# EAGLE schematic Tracking_Bug (EAGLE 7.5.0)
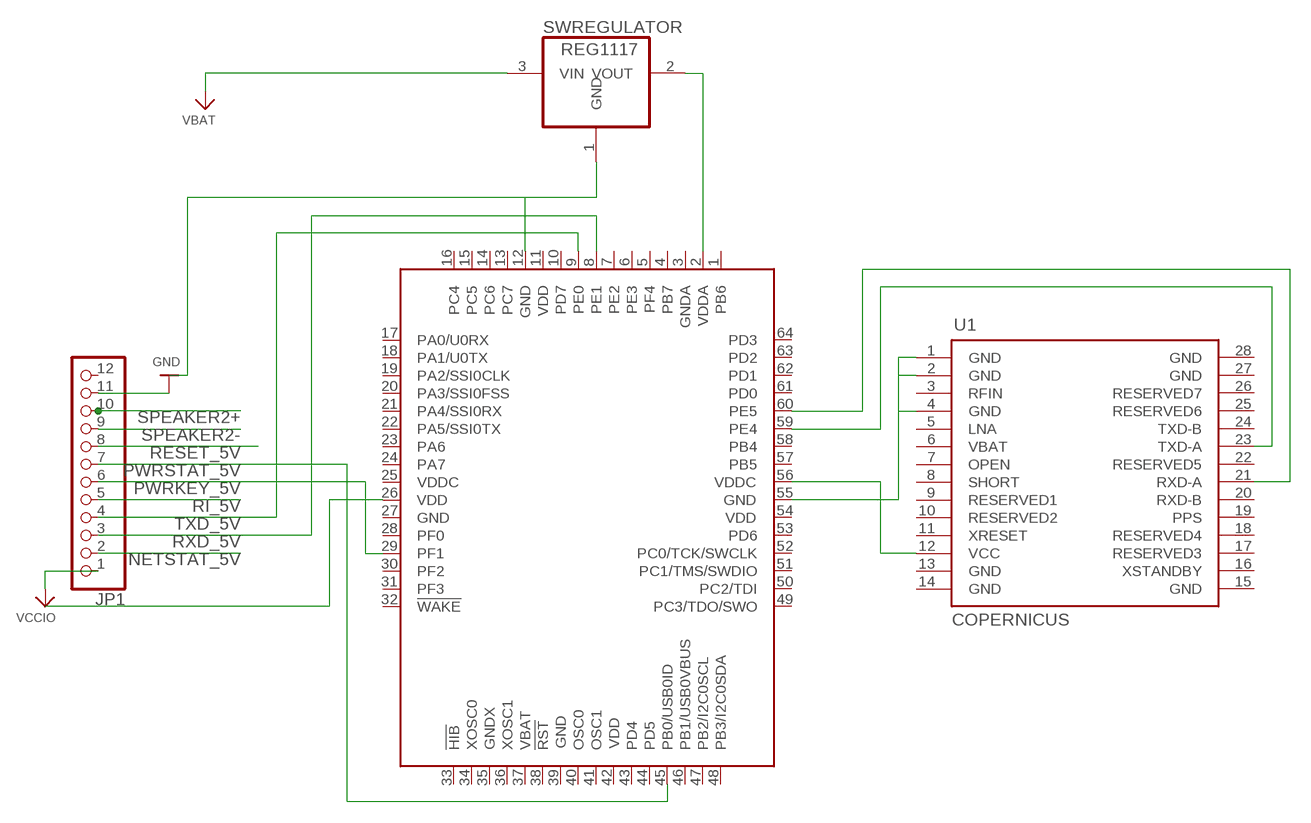
[diagram p0: schematic, sheet 1]

## Parts
IC1  TM4C123[7,G]XXPM  [PM_S-PQFP-G64]
JP1  PINHD-1X12-CB  [1X12-CB]
SWREGULATOR  REG1117  [SOT223]
U1  COPERNICUS  COPERNICUSSMD  [COPERNICUS]

## Nets
GND: JP1.11
N$1: IC1.59(PE4) U1.23(TXD-A)
N$2: IC1.60(PE5) U1.21(RXD-A)
N$3: IC1.55(GND) U1.1(GND) U1.2(GND) U1.4(GND)
N$4: IC1.56(VDDC) U1.12(VCC)
N$5: IC1.26(VDD)
N$6: IC1.12(GND) SWREGULATOR.1(GND)
N$8: IC1.2(VDDA) SWREGULATOR.2(VOUT)
NETSTAT_5V: JP1.2
PWRKEY_5V: IC1.29(PF1) JP1.6
PWRSTAT_5V: IC1.45(PB0/USB0ID) JP1.7
RESET_5V: JP1.8
RI_5V: JP1.5
RXD_5V: IC1.8(PE1) JP1.3
SPEAKER2+: JP1.10
SPEAKER2-: JP1.9
TXD_5V: IC1.9(PE0) JP1.4
VBAT: SWREGULATOR.3(VIN)
VCCIO: JP1.1
Unconnected: IC1.1(PB6) IC1.3(GNDA) IC1.4(PB7) IC1.5(PF4) IC1.6(PE3) IC1.7(PE2) IC1.10(PD7) IC1.11(VDD) IC1.13(PC7) IC1.14(PC6) IC1.15(PC5) IC1.16(PC4) IC1.17(PA0/U0RX) IC1.18(PA1/U0TX) IC1.19(PA2/SSI0CLK) IC1.20(PA3/SSI0FSS) IC1.21(PA4/SSI0RX) IC1.22(PA5/SSI0TX) IC1.23(PA6) IC1.24(PA7) IC1.25(VDDC) IC1.27(GND) IC1.28(PF0) IC1.30(PF2) IC1.31(PF3) IC1.32(!WAKE) IC1.33(!HIB) IC1.34(XOSC0) IC1.35(GNDX) IC1.36(XOSC1) IC1.37(VBAT) IC1.38(!RST) IC1.39(GND) IC1.40(OSC0) IC1.41(OSC1) IC1.42(VDD) IC1.43(PD4) IC1.44(PD5) IC1.46(PB1/USB0VBUS) IC1.47(PB2/I2C0SCL) IC1.48(PB3/I2C0SDA) IC1.49(PC3/TDO/SWO) IC1.50(PC2/TDI) IC1.51(PC1/TMS/SWDIO) IC1.52(PC0/TCK/SWCLK) IC1.53(PD6) IC1.54(VDD) IC1.57(PB5) IC1.58(PB4) IC1.61(PD0) IC1.62(PD1) IC1.63(PD2) IC1.64(PD3) JP1.12 U1.3(RFIN) U1.5(LNA) U1.6(VBAT) U1.7(OPEN) U1.8(SHORT) U1.9(RESERVED1) U1.10(RESERVED2) U1.11(XRESET) U1.13(GND) U1.14(GND) U1.15(GND) U1.16(XSTANDBY) U1.17(RESERVED3) U1.18(RESERVED4) U1.19(PPS) U1.20(RXD-B) U1.22(RESERVED5) U1.24(TXD-B) U1.25(RESERVED6) U1.26(RESERVED7) U1.27(GND) U1.28(GND)

## Library data of the parts
IC1 = ti-tiva:TM4C123[7,G]XX
JP1 = adafruit2:PINHD-1X12: PIN HEADER
SWREGULATOR = burr-brown:REG1117: 800mA and 1A Low Dropout (LDO) Positive Regulator 1.8V, 2.5V, 2.85V, 3.3V, 5V, and Adj; MPN: REG1117; OC_FARNELL: 1097566; OC_NEWARK: 14P6981
U1 = SparkFun-RF:COPERNICUS: Copernicus II GPS- Trimble recommended layout and paste layer. Footprint production proven. Spark Fun Electronics SKU : GPS-07951